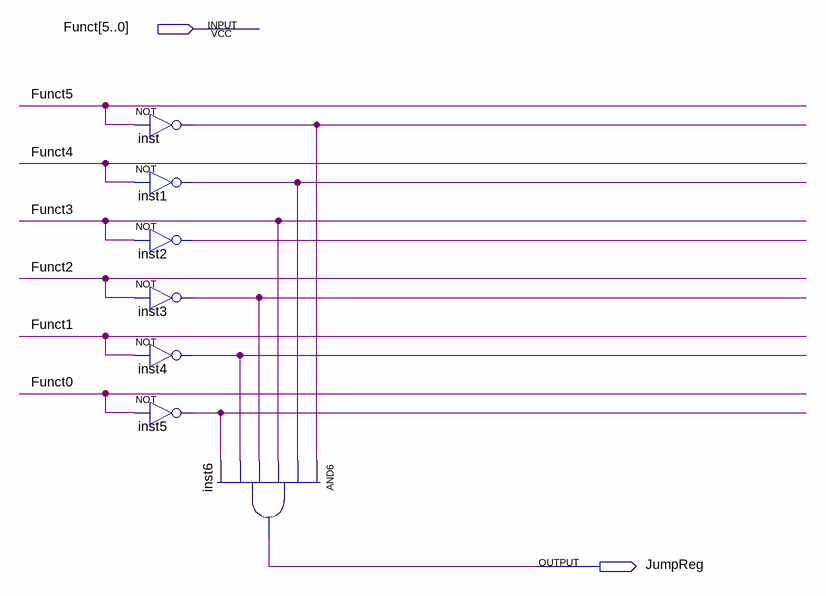
[diagram p0: schematic sheet]
// Quartus schematic control_r.bdf as structural Verilog: 7 symbols, 2 pins
module control_r (
  input  [5:0] Funct,
  output JumpReg
);

  wire inst1_out, inst2_out, inst3_out, inst4_out, inst5_out, inst_out;

  not inst (inst_out, Funct[5]);
  not inst1 (inst1_out, Funct[4]);
  not inst2 (inst2_out, Funct[3]);
  not inst3 (inst3_out, Funct[2]);
  not inst4 (inst4_out, Funct[1]);
  not inst5 (inst5_out, Funct[0]);
  and inst6 (JumpReg, inst_out, inst1_out, Funct[3], inst3_out, inst4_out, inst5_out);
endmodule
